# EasyEDA Pro project ProPrj_CGM_BH66F2455_HT32F67595_V1.0.epro

# Schematic CGM_BH66F2455_HT32F67595
Board Name: Board1; Create Date: 2024-12-17; Page Name: P1; Project Name: CGM_BH66F2455_HT32F67595; Schematic Name: CGM_BH66F2455_HT32F67595; Update Date: 2025-05-26; Company: BestHealth; Drawed: viking; Page Size: A4; Version: V1.0
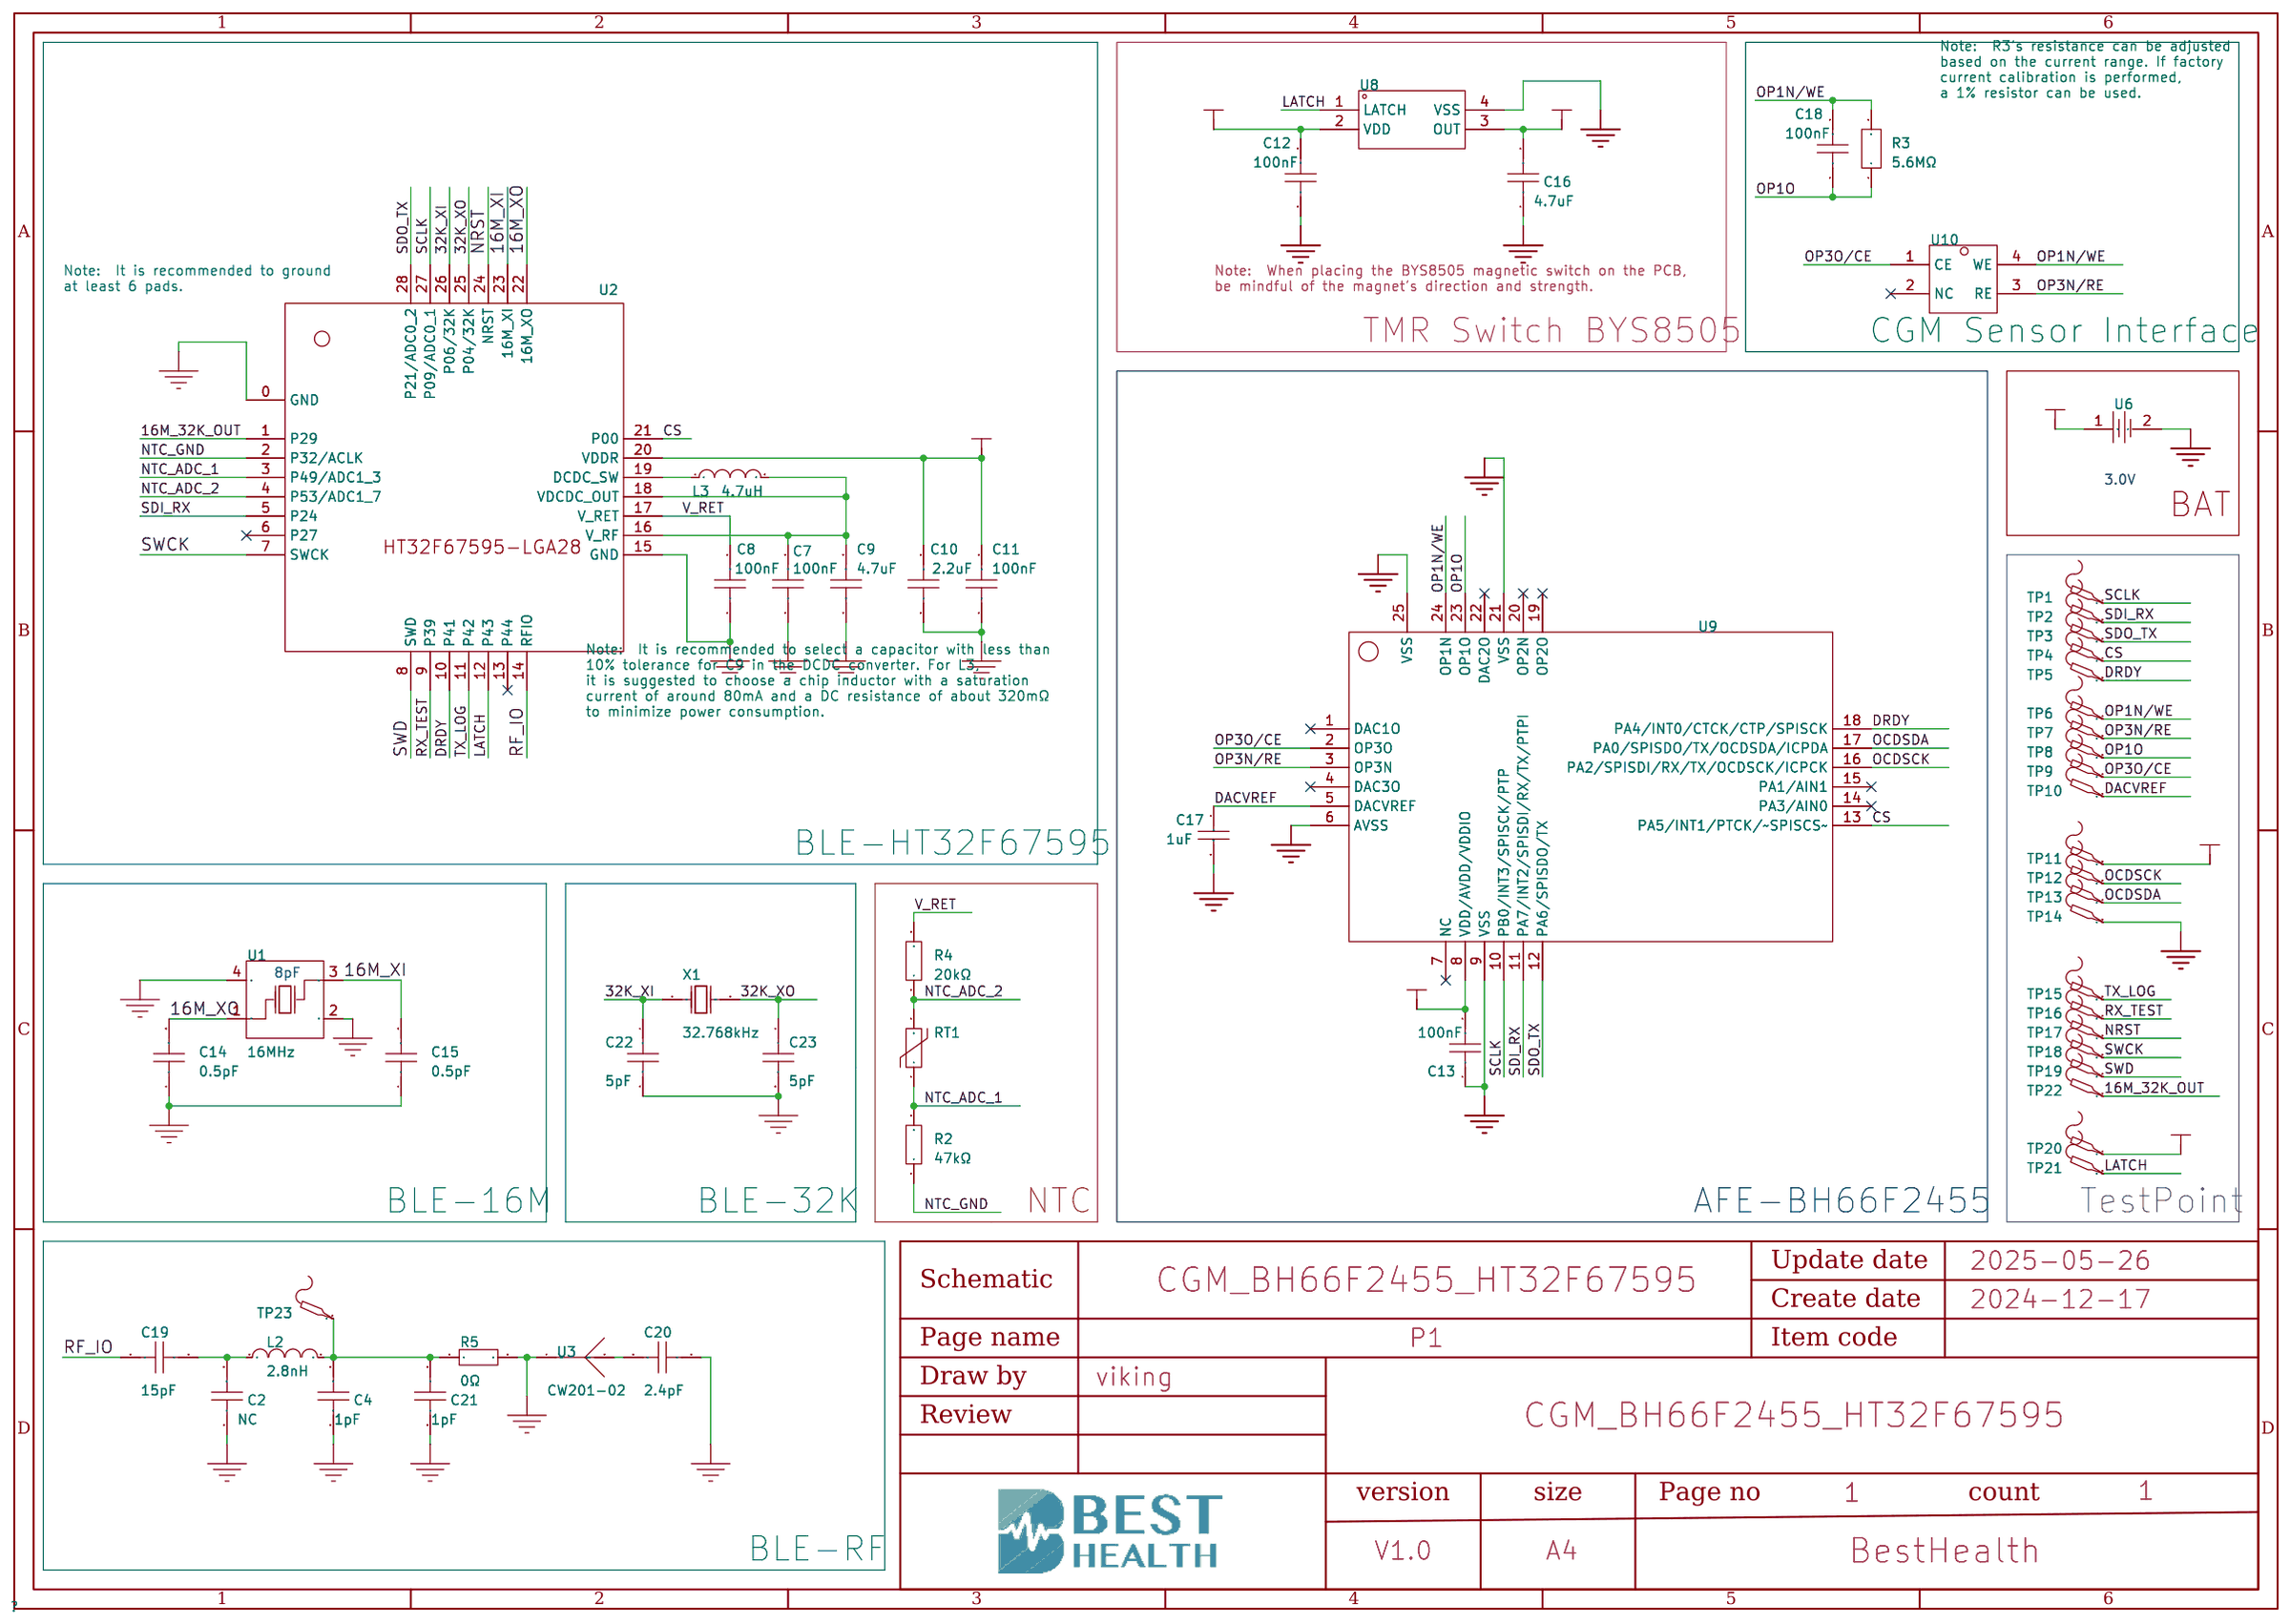
[diagram p0: schematic sheet]

## Parts
C2  1.2pF  [C0201]
C4  1pF  [C0201]
C7  100nF  [C0201]
C8  100nF  [C0201]
C9  4.7uF  [C0402]
C10  2.2uF  [C0201]
C11  100nF  [C0201]
C12  100nF  [C0201]
C13  100nF  [C0201]
C14  0.5pF  [C0201]  (no BOM)
C15  0.5pF  [C0201]  (no BOM)
C16  4.7uF  [C0201]
C17  1uF  [C0201]
C18  100nF  [C0201]
C19  15pF  [C0201]
C20  2.4pF  [C0201]
C21  1pF  [C0201]
C22  5pF  [C0201]  (no BOM)
C23  5pF  [C0201]  (no BOM)
L2  2.8nH  [L0201-RD]
L3  4.7uH  [L0603]
R2  47kΩ  [R0201]
R3  5.6MΩ  [R0402]
R4  20kΩ  [R0201]
R5  0Ω  [R0201]
RT1  NTCG064BF473FTBX  [R0201]
TP1  TP1  [TESTPOINT_1]  (no BOM)
TP2  TP1  [TESTPOINT_1]  (no BOM)
TP3  TP1  [TESTPOINT_1]  (no BOM)
TP4  TP1  [TESTPOINT_1]  (no BOM)
TP5  TP1  [TESTPOINT_1]  (no BOM)
TP6  TP1  [TESTPOINT_1]  (no BOM)
TP7  TP1  [TESTPOINT_1]  (no BOM)
TP8  TP1  [TESTPOINT_1]  (no BOM)
TP9  TP1  [TESTPOINT_1]  (no BOM)
TP10  TP1  [TESTPOINT_1]  (no BOM)
TP11  TP1  [TESTPOINT_1]  (no BOM)
TP12  TP1  [TESTPOINT_1]  (no BOM)
TP13  TP1  [TESTPOINT_1]  (no BOM)
TP14  TP1  [TESTPOINT_1]  (no BOM)
TP15  -  [TESTPOINT_1]  (no BOM)
TP16  -  [TESTPOINT_1]  (no BOM)
TP17  -  [TESTPOINT_1]  (no BOM)
TP18  -  [TESTPOINT_1]  (no BOM)
TP19  -  [TESTPOINT_1]  (no BOM)
TP20  -  [TESTPOINT_1]  (no BOM)
TP21  -  [TESTPOINT_1]  (no BOM)
TP22  -  [TESTPOINT_1]  (no BOM)
TP23  -  [TESTPOINT_1]  (no BOM)
U1  16MHz  [CRYSTAL-SMD_4P-L2.0-W1.6-BL-A]
U2  HT32F67595_LGA28  [LGA28_L3.0_W3.0mm]
U3  CW201-02  [ANT-SMD_L2.0-W1.2_CW201]
U6  CR920  [CR920 Henli Max]
U8  -  [LGA-4_L1.5-W1.5-P0.65-BL]
U9  -  [WQFN-24_L3.0-W3.0-P0.40-TL-EP1.9]
U10  -  [CGM_Sener_V2_TBJ]
X1  32.768kHz  [CRYSTAL-SMD_L1.7-W1.1]

## Library data of the parts
C2 = GJM0335C1H1R2WB01D: 容值:1.2pF;额定电压:50V;材质(温度系数):C0G;; LCSC Part Name: 1.2pF 50V; Supplier Part: C1864231; Manufacturer: muRata(村田); Supplier Footprint: 0201; JLCPCB Part Class: 扩展库; Datasheet: https://atta.szlcsc.com/upload/public/pdf/source/20210503/69FEFD345367A6ED6565135E0189A381.pdf; Supplier: LCSC; Voltage Rated: 50V; Temperature Coefficient: C0G
C4 C21 = GRM0335C1H1R0BA01D: 容值:1pF;精度:-;额定电压:50V;材质(温度系数):C0G;; LCSC Part Name: 1pF 50V; Supplier Part: C85893; Manufacturer: muRata(村田); Supplier Footprint: 0201; JLCPCB Part Class: 扩展库; Datasheet: https://atta.szlcsc.com/upload/public/pdf/source/20200305/C490387_23319AE8C154DEB24C505E6C82A8106A.pdf; Supplier: LCSC; Voltage Rated: 50V; Temperature Coefficient: C0G
C7 C8 C11-C13 C18 = CL03A104KO3NNNC: 容值:100nF;精度:±10%;额定电压:16V;材质(温度系数):X5R;; LCSC Part Name: 100nF ±10% 16V; Supplier Part: C307380; Manufacturer: SAMSUNG(三星); Supplier Footprint: 0201; JLCPCB Part Class: 扩展库; Datasheet: https://atta.szlcsc.com/upload/public/pdf/source/20181009/C307380_E0679AAF9658ADA26DBF30CED0CA6925.pdf; Supplier: LCSC; Tolerance: ±10%; Voltage Rated: 16V; Temperature Coefficient: X5R
C9 = CC0402KRX5R6BB475: 容值:4.7uF;精度:±10%;额定电压:10V;材质(温度系数):X5R;; LCSC Part Name: 4.7uF ±10% 10V; Supplier Part: C326586; Manufacturer: YAGEO(国巨); Supplier Footprint: 0402; Datasheet: https://atta.szlcsc.com/upload/public/pdf/source/20181031/C326586_0A24D5FB832C927D854568E36BF9A1E3.pdf; Supplier: LCSC; Tolerance: ±10%; Voltage Rated: 10V; Temperature Coefficient: X5R
C10 = GRM033R61A225ME47D: 容值:2.2uF;精度:±20%;额定电压:10V;材质(温度系数):X5R;; LCSC Part Name: 2.2uF ±20% 10V; Supplier Part: C319184; Manufacturer: muRata(村田); Supplier Footprint: 0201; JLCPCB Part Class: 扩展库; Datasheet: https://atta.szlcsc.com/upload/public/pdf/source/20181029/C319184_E8D08B09A5B8275146DCCD460C2C3E2F.pdf; Supplier: LCSC; Tolerance: ±20%; Voltage Rated: 10V; Temperature Coefficient: X5R
C14 C15 = GRM0335C1HR50BA01D: 容值:0.5pF;额定电压:50V;温度系数:C0G;; LCSC Part Name: ±0.1pF 0.5pF 50V; Supplier Part: C85920; Manufacturer: muRata(村田); Supplier Footprint: 0201; Datasheet: https://atta.szlcsc.com/upload/public/pdf/source/20200305/C490387_23319AE8C154DEB24C505E6C82A8106A.pdf; Supplier: LCSC; Voltage Rating: 50V; Temperature Coefficient: C0G
C16 = GRM035R60J475ME15D: 容值:4.7uF;精度:±20%;额定电压:6.3V;材质(温度系数):X5R;; LCSC Part Name: 4.7uF ±20% 6.3V; Supplier Part: C335103; Manufacturer: muRata(村田); Supplier Footprint: 0201; JLCPCB Part Class: 扩展库; Datasheet: https://atta.szlcsc.com/upload/public/pdf/source/20181123/C335103_65BC12EC0C1BBB7D605A3646AEC2CDDD.pdf; Supplier: LCSC; Tolerance: ±20%; Voltage Rated: 6.3V; Temperature Coefficient: X5R
C17 = CL03A105MQ3CSNH: 容值:1uF;精度:±20%;额定电压:6.3V;材质(温度系数):X5R;; LCSC Part Name: 1uF ±20% 6.3V; Supplier Part: C53067; Manufacturer: SAMSUNG(三星); Supplier Footprint: 0201; JLCPCB Part Class: 扩展库; Datasheet: https://atta.szlcsc.com/upload/public/pdf/source/20160218/1457707763339.pdf; Supplier: LCSC; Tolerance: ±20%; Voltage Rated: 6.3V; Temperature Coefficient: X5R
C19 = GRM0335C1H150JA01D: 容值:15pF;精度:±5%;额定电压:50V;温度系数:C0G;; LCSC Part Name: 15pF ±5% 50V; Supplier Part: C85891; Manufacturer: muRata(村田); Supplier Footprint: 0201; JLCPCB Part Class: 扩展库; Datasheet: https://atta.szlcsc.com/upload/public/pdf/source/20200305/C490387_23319AE8C154DEB24C505E6C82A8106A.pdf; Supplier: LCSC; Tolerance: ±5%; Voltage Rating: 50V; Temperature Coefficient: C0G
C20 = GRM0335C1E2R4CA01D: 容值:2.4pF;额定电压:25V;温度系数:C0G;; LCSC Part Name: ±0.25pF 2.4pF 25V; Supplier Part: C161385; Manufacturer: muRata(村田); Supplier Footprint: 0201; JLCPCB Part Class: 扩展库; Datasheet: https://atta.szlcsc.com/upload/public/pdf/source/20181011/C161385_74F8CDF2090FF44140FE7D4D8FB954E7.pdf; Supplier: LCSC; Voltage Rating: 25V; Temperature Coefficient: C0G
C22 C23 = GJM0335C1E5R0BB01D: 容值:5pF;额定电压:25V;材质(温度系数):C0G;; LCSC Part Name: 5pF 25V; Supplier Part: C464954; Manufacturer: muRata(村田); Supplier Footprint: 0201; JLCPCB Part Class: 扩展库; Datasheet: https://atta.szlcsc.com/upload/public/pdf/source/20191129/C464954_5BF7E89BC2BFACC5C6B733268D26AC03.pdf; Supplier: LCSC; Voltage Rated: 25V; Temperature Coefficient: C0G
L2 = LQP03TG2N8B02D: 电感值:2.8nH;精度:-;额定电流:450mA;饱和电流(Isat):-;直流电阻(DCR):250mΩ;; Supplier Part: C237463; Manufacturer: muRata(村田); Supplier Footprint: 0201; Datasheet: https://atta.szlcsc.com/upload/public/pdf/source/20181120/C333991_3B037B5A0300CC3F313E5A09B9D1E037.pdf; Supplier: LCSC; Rated Current: 450mA; DC Resistance (DCR): 250mΩ; Q @ Freq: 13@500MHz; Frequency - Self Resonant: 6GHz; Type: 厚膜电感
L3 = MLZ1608N4R7LT000: 电感值:4.7uH;精度:±20%;额定电流:-;饱和电流(Isat):80mA;直流电阻(DCR):320mΩ;; LCSC Part Name: 4.7uH ±20% 80mA; Supplier Part: C383396; Manufacturer: TDK; Supplier Footprint: 0603; JLCPCB Part Class: 扩展库; Datasheet: https://atta.szlcsc.com/upload/public/pdf/source/20200619/C383390_12B08DE970320BE328D08C37492510E7.pdf; Supplier: LCSC; Tolerance: ±20%; Saturation Current (Isat): 80mA; DC Resistance (DCR): 320mΩ; Frequency - Self Resonant: 80MHz
R2 = RC0201FR-0747KL: 电阻类型:厚膜电阻;阻值:47kΩ;精度:±1%;功率:50mW;温度系数:±200ppm/℃;最大工作电压:25V;工作温度范围:-55℃~+155℃;; LCSC Part Name: 47kΩ ±1% 50mW; Supplier Part: C138139; Manufacturer: YAGEO(国巨); Supplier Footprint: 0201; JLCPCB Part Class: 扩展库; Datasheet: https://atta.szlcsc.com/upload/public/pdf/source/20171107/C138139_15100517155931097035.pdf; Supplier: LCSC; Type: 厚膜电阻; Tolerance: ±1%; Power(Watts): 50mW; Temperature Coefficient: ±200ppm/℃; Overload Voltage (Max): 25V; Operating Temperature Range: -55℃~+155℃
R3 = RC0402FR-075M6L: 电阻类型:厚膜电阻;阻值:5.6MΩ;精度:±1%;功率:62.5mW;最大工作电压:50V;温度系数:±100ppm/℃;; LCSC Part Name: 厚膜电阻 5.6MΩ ±1% 62.5mW; Supplier Part: C477755; Manufacturer: YAGEO(国巨); Supplier Footprint: 0402; JLCPCB Part Class: 扩展库; Datasheet: https://atta.szlcsc.com/upload/public/pdf/source/20200715/C477755_2FF05B608096128DB9D1572F7AA4D559.pdf; Supplier: LCSC; Type: 厚膜电阻; Tolerance: ±1%; Power(Watts): 62.5mW; Overload Voltage (Max): 50V; Temperature Coefficient: ±100ppm/℃; Operating Temperature Range: -55℃~+155℃
R4 = RC0201FR-0720KL: 电阻类型:厚膜电阻;阻值:20kΩ;精度:±1%;功率:50mW;最大工作电压:25V;温度系数:±200ppm/℃;; LCSC Part Name: 厚膜电阻 20kΩ ±1% 50mW; Supplier Part: C295787; Manufacturer: YAGEO(国巨); Supplier Footprint: 0201; JLCPCB Part Class: 扩展库; Datasheet: https://atta.szlcsc.com/upload/public/pdf/source/20181009/C309620_DA5935B6E1D48212CB7A533FE518B3C2.pdf; Supplier: LCSC; Type: 厚膜电阻; Tolerance: ±1%; Power(Watts): 50mW; Overload Voltage (Max): 25V; Temperature Coefficient: ±200ppm/℃; Operating Temperature Range: -55℃~+125℃
R5 = RC0201FR-070RL: 电阻类型:厚膜电阻;阻值:0Ω;精度:±1%;功率:50mW;最大工作电压:25V;温度系数:-;; LCSC Part Name: 厚膜电阻 0Ω ±1% 50mW; Supplier Part: C106227; Manufacturer: YAGEO(国巨); Supplier Footprint: 0201; Datasheet: https://atta.szlcsc.com/upload/public/pdf/source/20180821/C275644_0D56F95EFF785E7D9A1FEF436B37DA78.pdf; Supplier: LCSC; Type: 厚膜电阻; Tolerance: ±1%; Power(Watts): 50mW; Overload Voltage (Max): 25V; Operating Temperature Range: -55℃~+125℃
RT1 = NTCG064BF473FTBX: 阻值(25℃):47kΩ;电阻精度:±1%;B值精度:±1%;B值(25℃/50℃):4050K;功率:100mW;最大稳态电流(25℃):140uA;; LCSC Part Name: 47kΩ 电阻精度:±1% 4050K; Supplier Part: C387869; Manufacturer: TDK; Supplier Footprint: 0201; JLCPCB Part Class: 扩展库; Datasheet: https://atta.szlcsc.com/upload/public/pdf/source/20190412/C387869_7488A33476C163DAFB157DE1B3701229.pdf; Supplier: LCSC; Resistance @ 25℃: 47kΩ; Resistance Tolerance: ±1%; B Constant Tolerance: ±1%; B Constant (25℃/50℃): 4050K; Power: 100mW; Steady State Current (Max): 140uA; B Constant (25℃/75℃): 4098K; B Constant (25℃/85℃): 4114K; B Constant (25℃/100℃): 4137K; Operating Temperature: -40℃~+125℃
TP1-TP23 = Test-Point: Test Point 测试点
U1 = XL7EL89CKI-111YLC-16M: 频率:16MHz;负载电容:8pF;频率公差:±10ppm;; LCSC Part Name: 16MHz ±10ppm 8pF YSX211SL; Supplier Part: C2965577; Manufacturer: YXC(扬兴晶振); Supplier Footprint: SMD2016-4P; Datasheet: https://atta.szlcsc.com/upload/public/pdf/source/20220121/6B4B3E7EF7974858943D806BF8CACEA3.pdf; Supplier: LCSC; Crystal Type: 贴片无源晶振; Load Capacitance: 8pF; Frequency Tolerance: ±10ppm; Frequency Stability: ±20ppm; Operating Temperature: -40℃~+85℃
U2 = HT32F67595_LGA28: Check: true
U3 = CW201-02: LCSC Part Name: LXC(连兴创)陶瓷SMT天线-CW201; Supplier Part: C42379496; Manufacturer: LXC(连兴创); JLCPCB Part Class: 扩展库; Datasheet: https://atta.szlcsc.com/upload/public/pdf/source/20241122/D5EBC13B9CDD4B62BA2D0887DE2C1252.pdf; Supplier: LCSC
U6 = CR920 Henli Max: 常州宇峰电池
U8 = BYS8505
U9 = BH66F2455: 该单片机是一款 A/D 型具有 8 位高性能精简指令集的 Flash 单片机，内置连续 / 血糖监测 AFE 模块，专门为连续血糖监测产品而设计。; Manufacturer: HOLTEK
U10 = CGM_Sensor_V2_TBJ
X1 = X1A0001210005_C5154201: 频率:32.768kHz;外接负载电容:12.5pF;; LCSC Part Name: 32.768kHz 12.5pF; Supplier Part: C5154201; Manufacturer: EPSON(爱普生); Manufacturer Part: X1A0001210005; Supplier Footprint: SMD1610-2P; Datasheet: https://atta.szlcsc.com/upload/public/pdf/source/20220902/8E45647E0861F7DDF8A395DB16B8FC1E.pdf; Supplier: LCSC; External load capacitor: 12.5pF

## Nets
GND: C2.1 C4.1 C7.1 C8.1 C9.1 C10.1 C11.1 C12.1 C13.1 C14.1 C15.1 C16.1 C17.2 C20.1 C21.1 C22.2 C23.2 R5.2 TP14.1 U1.2(GND) U1.4(GND) U2.0(GND) U2.15(GND) U3.1(Signal Input) U6.2 U8.4(VSS) U9.6(AVSS) U9.9(VSS) U9.21(VSS) U9.25(VSS)
VBAT: C12.2 TP20.1 U6.1 U8.2(VDD)
VDD: C10.2 C11.2 C13.2 C16.2 TP11.1 U2.20(VDDR) U8.3(OUT) U9.8(VDD/AVDD/VDDIO)
16M_32K_OUT: TP22.1 U2.1(P29)
16M_XI: C15.2 U1.3(OSC2) U2.23(16M_XI)
16M_XO: C14.2 U1.1(OSC1) U2.22(16M_XO)
32K_XI: C22.1 U2.26(P06/32K) X1.1(OSC1)
32K_XO: C23.1 U2.25(P04/32K) X1.2(OSC2)
CS: TP4.1 U2.21(P00) U9.13(PA5/INT1/PTCK/~SPISCS~)
DACVREF: C17.1 TP10.1 U9.5(DACVREF)
DRDY: TP5.1 U2.10(P41) U9.18(PA4/INT0/CTCK/CTP/SPISCK)
LATCH: TP21.1 U2.12(P43) U8.1(LATCH)
NRST: TP17.1 U2.24(NRST)
NTC_ADC_1: R2.2 RT1.1 U2.3(P49/ADC1)
NTC_ADC_2: R4.1 RT1.2 U2.4(P53/ADC1_7)
NTC_GND: R2.1 U2.2(P32/ACLK)
OCDSCK: TP12.1 U9.16(PA2/SPISDI/RX/TX/OCDSCK/ICPCK)
OCDSDA: TP13.1 U9.17(PA0/SPISDO/TX/OCDSDA/ICPDA)
OP1N/WE: C18.2 R3.2 TP6.1 U9.24(OP1N) U10.4(WE)
OP1O: C18.1 R3.1 TP8.1 U9.23(OP1O)
OP3N/RE: TP7.1 U9.3(OP3N) U10.3(RE)
OP3O/CE: TP9.1 U9.2(OP3O) U10.1(CE)
RF_IO: C19.1 U2.14(RFIO)
RX_TEST: TP16.1 U2.9(P39)
SCLK: TP1.1 U2.27(P09/ADC0_1) U9.10(PB0/INT3/SPISCK/PTP)
SDI_RX: TP2.1 U2.5(P24) U9.11(PA7/INT2/SPISDI/RX/TX/PTPI)
SDO_TX: TP3.1 U2.28(P21/ADC0_2) U9.12(PA6/SPISDO/TX)
SWCK: TP18.1 U2.7(SWCK)
SWD: TP19.1 U2.8(SWD)
TX_LOG: TP15.1 U2.11(P42)
V_RET: C8.2 R4.2 U2.17(V_RET)
$1N117316: L3.1 U2.19(DCDC_SW)
$1N117324: C20.2 U3.2(Tuning/Signal Output)
$1N117351: C7.2 C9.2 L3.2 U2.16(V_RF) U2.18(VDCDC_OUT)
$1N163267: C2.2 C19.2 L2.1
$1N163559: C4.2 C21.2 L2.2 R5.1 TP23.1

Not connected (* = marked no-connect by the designer): U2 6(P27)* 13(P44)*; U9 1(DAC1O)* 4(DAC3O)* 7(NC)* 14(PA3/AIN0)* 15(PA1/AIN1)* 19(OP2O)* 20(OP2N)* 22(DAC2O)*; U10 2(NC)*

## Notes on the sheet
- Note:  R3's resistance can be adjusted
  based on the current range. If factory
  current calibration is performed,
  a 1% resistor can be used.
- Note:  It is recommended to ground
  at least 6 pads.
- Note:  When placing the BYS8505 magnetic switch on the PCB,
  be mindful of the magnet's direction and strength.
- TMR Switch BYS8505
- CGM Sensor Interface
- 3.0V
- BAT
- Note:  It is recommended to select a capacitor with less than
  10% tolerance for C9 in the DCDC converter. For L3,
  it is suggested to choose a chip inductor with a saturation
  current of around 80mA and a DC resistance of about 320mΩ
  to minimize power consumption.
- BLE-HT32F67595
- 8pF
- BLE-16M
- BLE-32K
- NTC
- AFE-BH66F2455
- TestPoint
- BLE-RF

# Board CGM_BH66F2455_HT32F67595
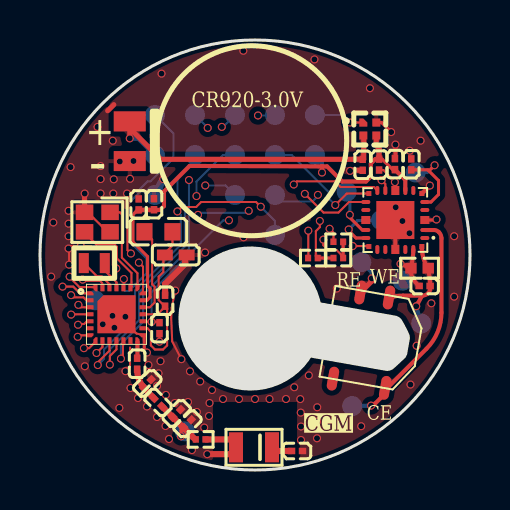
[diagram p1: board, top side]
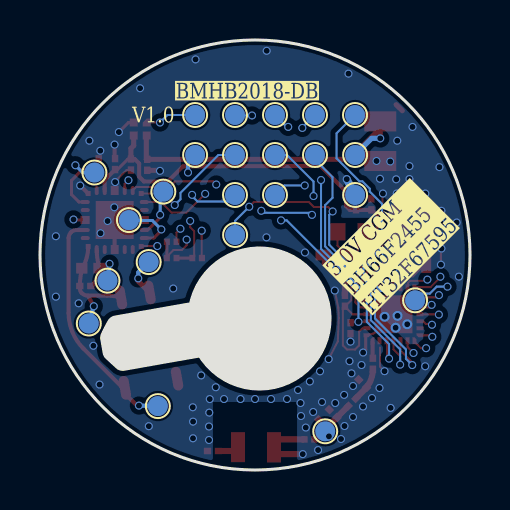
[diagram p2: board, bottom side, seen from below]

Outline 21.5 x 21.5 mm; copper layers: Top Layer, Inner1, Inner2, Bottom Layer. Coordinates in mm from the lower left corner of the outline.
Outline path: circle c10.75,10.75 r10.75
Stack: Top Layer 0.035mm 外层铜厚1oz / Dielectric1 0.2133mm 7628 RC49% 8.6mil / Inner1 0.035mm 内层铜厚 / Dielectric2 0.2133mm 1.1mm H/HOZ Copper / Inner2 0.035mm 内层铜厚 / Dielectric3 0.2133mm 7628 RC49% 8.6mil / Bottom Layer 0.035mm 外层铜厚1oz

## Design rules (mm)
template: 自定义配置
spacing copperThickness1oz (default): track to track 0.102, other pairs 0.102 to 0.3
spacing copperThickness2oz: track to track 0.203, other pairs 0.152 to 0.3
spacing copperThicknessInner0.5oz: track to track 0.089, other pairs 0.152 to 0.3
track width copperThickness1oz (default): min 0.102, default 0.254, max 2.54
track width copperThickness2oz: min 0.203, default 0.254, max 2.54
track width copperThickness0.5oz: min 0.089, default 0.254, max 2.54
differential pair differentialPair (default): width min 0.127, default 0.254, max 2.54; gap min 0.152, default 0.152
via viaSize (default): diameter min 0.3, default 0.61, max 10; hole min 0.201, default 0.305, max 6.299

## Placement (name value [footprint] x y rotation side)
C2  1.2pF  [C0201]  5.37 4.32 225 top
C4  1pF  [C0201]  6.84 2.83 225 top
C7  100nF  [C0201]  6.25 8.46 270 top
C8  100nF  [C0201]  5.97 7.09 90 top
C9  4.7uF  [C0402]  6.79 10.75 180 top
C10  2.2uF  [C0201]  4.93 13.28 270 top
C11  100nF  [C0201]  5.7 13.29 270 top
C12  100nF  [C0201]  16.13 15.26 90 top
C13  100nF  [C0201]  17.75 15.3 270 top
C16  4.7uF  [C0201]  16.95 15.27 90 top
C17  1uF  [C0201]  18.56 15.28 90 top
C18  100nF  [C0201]  19.23 9.2 0 top
C19  15pF  [C0201]  4.86 5.31 270 top
C20  2.4pF  [C0201]  12.85 0.95 180 top
C21  1pF  [C0201]  7.37 2.32 225 top
L2  2.8nH  [L0201-RD]  5.9 3.38 315 top
L3  4.7uH  [L0603]  5.92 11.91 0 top
R2  47kΩ  [R0201]  14.92 11.41 0 top
R3  5.6MΩ  [R0402]  18.98 10.09 0 top
R4  20kΩ  [R0201]  13.65 10.6 180 top
R5  0Ω  [R0201]  8.03 1.53 0 top
RT1  NTCG064BF473FTBX  [R0201]  14.92 10.6 180 top
TP1  TP1  [TESTPOINT_1]  11.75 13.75 0 bottom
TP2  TP1  [TESTPOINT_1]  9.75 13.75 0 bottom
TP3  TP1  [TESTPOINT_1]  11.75 15.75 0 bottom
TP4  TP1  [TESTPOINT_1]  9.75 15.75 0 bottom
TP5  TP1  [TESTPOINT_1]  11.75 11.75 0 bottom
TP6  TP1  [TESTPOINT_1]  19.06 7.32 0 bottom
TP7  TP1  [TESTPOINT_1]  16.07 10.4 0 bottom
TP8  TP1  [TESTPOINT_1]  18.13 9.47 0 bottom
TP9  TP1  [TESTPOINT_1]  15.61 3.19 0 bottom
TP10  TP1  [TESTPOINT_1]  18.78 14.87 0 bottom
TP11  TP1  [TESTPOINT_1]  13.75 15.75 0 bottom
TP12  TP1  [TESTPOINT_1]  15.33 13.92 0 bottom
TP13  TP1  [TESTPOINT_1]  17.05 12.49 0 bottom
TP14  TP1  [TESTPOINT_1]  5.75 13.75 0 bottom
TP15  -  [TESTPOINT_1]  7.75 15.75 0 bottom
TP16  -  [TESTPOINT_1]  11.75 17.75 0 bottom
TP17  -  [TESTPOINT_1]  5.75 17.75 0 bottom
TP18  -  [TESTPOINT_1]  7.75 17.75 0 bottom
TP19  -  [TESTPOINT_1]  9.75 17.75 0 bottom
TP20  -  [TESTPOINT_1]  5.75 15.75 0 bottom
TP21  -  [TESTPOINT_1]  13.75 17.75 0 bottom
TP22  -  [TESTPOINT_1]  2.75 8.48 180 bottom
TP23  -  [TESTPOINT_1]  7.24 1.94 180 bottom
U1  16MHz  [CRYSTAL-SMD_4P-L2.0-W1.6-BL-A]  2.87 12.4 180 top
U2  HT32F67595_LGA28  [LGA28_L3.0_W3.0mm]  3.82 7.79 0 top
U3  CW201-02  [ANT-SMD_L2.0-W1.2_CW201]  10.7 1.13 0 top
U6  CR920  [CR920 Henli Max]  10.58 16.46 180 top
U8  -  [LGA-4_L1.5-W1.5-P0.65-BL]  16.49 17.05 270 top
U9  -  [WQFN-24_L3.0-W3.0-P0.40-TL-EP1.9]  17.77 12.5 180 top
U10  -  [CGM_Sener_V2_TBJ]  17.45 8.62 170 top
X1  32.768kHz  [CRYSTAL-SMD_L1.7-W1.1]  2.71 10.35 0 top

## Footprints (pads in the part's own frame, mm; a bottom-side part is the same pattern mirrored in y, then rotated)
ANT-SMD_L2.0-W1.2_CW201
  rect 0.7x1.5 smd: 1(-0.9,-0.001) 2(0.9,0.001)
C0201
  rect 0.368x0.324 smd: 1(-0.275,0) 2(0.275,0)
C0402
  rect 0.79x0.54 smd: 1(-0.545,0) 2(0.545,0)
CGM_Sener_V2_TBJ
  oval 0.5x1.2 smd: 1(-0.595,4.482) 2(2.055,4.482) 3(1.45,0) 4(0,0)
CR920 Henli Max
  rect 1.6x1 smd: 1(6.096,-0.968) 2(6.096,1.016)
CRYSTAL-SMD_4P-L2.0-W1.6-BL-A
  rect 0.875x0.775 smd: 1(-0.638,-0.488) 2(0.638,-0.488) 3(0.638,0.488) 4(-0.638,0.488)
CRYSTAL-SMD_L1.7-W1.1
  rect 0.5x1 smd: 1(-0.525,0) 2(0.525,0)
L0201-RD
  rect 0.368x0.324 smd: 1(-0.275,0) 2(0.275,0)
L0603
  rect 0.8x0.864 smd: 1(-0.7,0) 2(0.7,0)
LGA28_L3.0_W3.0mm
  custom 1.9x1.9 smd: 0(0,0)
  custom 0.35x0.2 smd: 1(-1.375,1.05) 7(-1.375,-1.05) 15(1.375,-1.05) 21(1.375,1.05)
  rect 0.35x0.2 smd: 2(-1.325,0.7) 3(-1.325,0.35) 4(-1.325,0) 5(-1.325,-0.35) 6(-1.325,-0.7) 16(1.325,-0.7) 17(1.325,-0.35) 18(1.325,0) 19(1.325,0.35) 20(1.325,0.7)
  custom 0.2x0.35 smd: 8(-1.05,-1.375) 14(1.05,-1.375) 22(1.05,1.375) 28(-1.05,1.375)
  rect 0.2x0.35 smd: 9(-0.7,-1.325) 10(-0.35,-1.325) 11(0,-1.325) 12(0.35,-1.325) 13(0.7,-1.325) 23(0.7,1.325) 24(0.35,1.325) 25(0,1.325) 26(-0.35,1.325) 27(-0.7,1.325)
LGA-4_L1.5-W1.5-P0.65-BL
  custom 0.4x0.4 smd: 1(-0.325,-0.325)
  rect 0.4x0.4 smd: 2(0.325,-0.325) 3(0.325,0.325) 4(-0.325,0.325)
R0201
  rect 0.303x0.324 smd: 1(-0.241,0) 2(0.241,0)
R0402
  rect 0.566x0.54 smd: 1(-0.433,0) 2(0.433,0)
TESTPOINT_1
  round 1 smd: 1(0,-0.001)
WQFN-24_L3.0-W3.0-P0.40-TL-EP1.9
  oval 0.45x0.2 smd: 1(-1.475,0.9) 2(-1.475,0.5) 4(-1.475,-0.5) 5(-1.475,-0.9) 13(1.475,-0.9) 14(1.475,-0.5) 16(1.475,0.5) 17(1.475,0.9)
  rect 0.45x0.4 smd: 3(-1.475,0) 15(1.475,0)
  rect 0.25x0.25 smd: 6(-1.325,-1.325) 12(1.325,-1.325) 18(1.325,1.325) 24(-1.325,1.325)
  oval 0.2x0.45 smd: 7(-0.9,-1.475) 8(-0.5,-1.475) 10(0.5,-1.475) 11(0.9,-1.475) 19(0.9,1.475) 20(0.5,1.475) 22(-0.5,1.475) 23(-0.9,1.475)
  rect 0.4x0.45 smd: 9(0,-1.475) 21(0,1.475)
  rect 1.9x1.9 smd: 25(0,0)

## Nets
As in the schematic.

Pads without a net: U2 6 13; U9 1 4 7 14 15 19 20 22; U10 2

## Via types
v1: diameter 0.4, hole 0.3, Top Layer to Bottom Layer, 139 vias
v2: diameter 0.5, hole 0.3, Top Layer to Bottom Layer, 4 vias

## Routing (per net, layer and track width the routed paths; a pad name or vN(x,y) marks a point on that pad's centre or on a via; arc(x,y) is an arc through that point)
GND: length 31
  Top Layer w0.102: v1(4.54,10.82) 4.37,10.99 4.37,13.8 v1(4.35,13.82) ; v1(1.45,10.27) 1.45,11.05 v1(1.43,11.07) 1.55,11.19 v1(2.04,11.19) 2.53,11.19 2.65,11.08 3.54,11.08 3.64,10.98 3.64,10.25 v1(3.81,10.08) ; C16.1 17.17,15 17.75,14.42 v1(17.75,14.4) arc(17.78,14.19) U9.9 ; U1.2 2.39,12.88 3.37,11.91 U1.4 ; v1(4.27,4.94) 4.5,5.17 4.5,6.12 ; U2.0 4.82,6.83 U2.15 ; C8.1 v1(5.97,6.42) ; v1(7.07,5.54) 6.61,6.43 6.56,7.6 6.58,8.11 v1(6.76,8.97)
  Top Layer w0.152: U2.15 5.21,6.72 5.21,6 v1(5.34,5.87) ; v1(17.56,16.9) 17.08,17.37 U8.4
  Top Layer w0.203: U9.21 U9.25 ; 19.09,13.82 19.09,13.82 v1(19.49,14.22) ; v1(17.77,16.27) 17.77,15.59 C13.1
  Top Layer w0.254: U1.2 2.23,13.82 v1(2.24,13.82) ; v1(15.5,14.96) 15.53,14.98 C12.1 ; 3.69,18.27 arc(3.54,18.11) 3.38,17.96
  Top Layer w0.305: C7.1 6.25,9.3 7.26,10.31 7.26,10.77 ; 8.31,1.53 9.8,1.53 U3.1 9.8,0.81 9.78,0.79 v1(8.36,0.79)
  Bottom Layer w0.381: v1(6.16,14.54) TP14.1
  vias: v1(0.56,9.67) v1(0.67,12.38) v1(1.43,12.96) v1(1.43,12.32) v1(1.43,11.69) v1(1.53,15.14) v1(2.24,5.19) v1(2.88,17.15) v1(3.03,15.19) v1(3.03,14.55) v1(3.03,13.83) v1(3.64,16.46) v1(3.69,14.53) v1(3.66,13.82) v1(3.99,15.42) v1(3.97,3.1) v1(4.5,14.56) v1(4.52,4.1) v1(4.67,15.45) v1(4.9,3.6) v1(5.35,3.17) v1(5.42,5.25) v1(5.85,4.2) v1(5.85,2.65) v1(5.93,4.83) v1(6.08,19.82) v1(6.03,5.44) v1(6.29,3.76) v1(6.28,2.2) v1(6.45,1.55) v1(6.74,3.35) v1(7.5,4.93) v1(7.4,3.4) v1(7.6,1) v1(7.84,2.9) v1(8.01,4.43) v1(8.25,10.88) v1(8.21,2.12) v1(8.47,3.35) v1(8.45,2.7) v1(8.6,4) v1(9.15,3.55) v1(9.95,3.55) v1(10.17,20.96) v1(10.18,11.63) v1(10.75,3.55) v1(11.47,3.55) v1(12.3,3.55) v1(12.71,4.14) v1(13.01,3.55) v1(13.04,2.87) v1(13.05,2.17) v1(13.05,1.5) v1(13.44,4.73) v1(13.72,20.53) v1(13.86,3.14) v1(13.85,2.42) v1(13.85,1.59) v1(14.84,9.07) v1(16.06,2.19) v1(16.5,19.09) v1(17.79,13.14) v1(18.12,12.45) v1(18.49,15.96) v1(18.47,11.84) v1(18.52,4.27) v1(18.83,6.21) v1(19.03,16.47) v1(19.57,8.34) v1(20.71,11.69) v1(20.71,8.67) v2(3.14,7.29) v2(3.62,7.71) v2(3.72,7.11) v2(4.27,7.66)
VBAT: length 16
  Top Layer w0.254: U8.2 16.19,16.7 16.19,15.53 6.04,15.53 4.49,17.08 ; U6.1 4.49,17.08 ; 4.49,17.08 v1(4.49,16.58)
  Bottom Layer w0.254: v1(4.49,16.58) 4.92,16.58 5.75,15.75
VDD: length 24.7
  Top Layer w0.152: C13.2 17.63,15.02 17.1,15.55 C16.2 ; C10.2 4.88,13.01 4.65,12.77 4.65,11.4 5.38,10.67 5.38,9.19 5.5,9.07 5.5,8.64 5.35,8.49 U2.20
  Top Layer w0.203: 14.1,15.18 7.48,15.2 6.2,13.92 6.2,13.2 6,13 5.71,13 C11.2 5.69,13.01 C10.2 ; 14.1,15.18 v1(14.1,14.87) ; 14.1,15.18 14.35,15.18 15.11,14.42 16.3,14.42 16.54,14.67 16.54,15.32 16.76,15.55 C16.2 ; U9.8 18.27,14.5 C13.2
  Top Layer w0.254: U8.3 16.82,16.22 16.95,16.08 C16.2
  Bottom Layer w0.203: v1(14.1,14.87) 14.1,15.39 TP11.1
16M_32K_OUT: length 3.4
  Top Layer w0.102: U2.1 1.99,8.84 1.66,9.17 v1(1.13,9.17)
  Bottom Layer w0.102: v1(1.13,9.17) 1.66,9.17 2.01,8.82 2.52,8.82 2.74,8.6 2.74,8.48
16M_XI: length 4.3
  Top Layer w0.102: U2.23 4.57,9.16 4.57,9.85 3.84,10.58 3.84,11.16 3.72,11.28 2.81,11.28 2.23,11.87 U1.3
16M_XO: length 4.6
  Top Layer w0.102: U1.1 3.99,12.88 4.09,12.78 4.09,10.62 4.87,9.84 U2.22
32K_XI: length 1.9
  Top Layer w0.102: X1.1 2.85,9.68 3.08,9.68 3.47,9.29 U2.26
32K_XO: length 1.5
  Top Layer w0.102: U2.25 3.82,9.39 3.24,9.97 X1.2
CS: length 20.1
  Top Layer w0.102: U2.21 5.15,8.88 5.15,10.17 v1(4.94,10.37) ; U9.13 15.45,13.4 14.92,12.87 14.18,12.87 v1(13.24,13.81)
  Inner2 w0.102: v1(13.24,13.81) 13.23,13.82 11.82,13.82 11.57,14.07 8.88,14.07 8.47,13.66 8.47,13.58 8.28,13.39 8.13,13.39 v1(7.82,13.7) 5.96,13.7 4.94,12.68 v1(4.94,10.37)
  Bottom Layer w0.102: v1(7.82,13.7) 7.82,14.42 9.15,15.75 9.75,15.75
DACVREF: length 4.6
  Top Layer w0.152: 19.45,14.95 19.93,14.47 19.93,13.77 19.55,13.4 U9.5 ; 19.45,14.95 19.39,15.01 C17.1 ; 19.45,14.95 v1(19.73,15.24)
  Bottom Layer w0.152: TP10.1 19.37,14.87 v1(19.73,15.24)
DRDY: length 23.5
  Top Layer w0.102: v1(2.89,5.25) 2.89,5.38 3.47,5.97 U2.10 ; v1(15.63,11.2) 16.42,11.2 U9.18 ; v1(11.04,13.16) 10.8,13.4 8.06,13.4 7.81,13.15 7.09,13.15 v1(6.87,12.93)
  Inner2 w0.102: v1(15.63,11.2) 14.94,11.89 14.94,12.27 14.19,13.03 11.76,13.03 11.62,13.16 v1(11.04,13.16)
  Bottom Layer w0.102: TP5.1 11.75,12.46 v1(11.04,13.16) ; v1(6.87,12.93) 7.04,12.75 7.04,11.27 4.75,8.98 4.75,7.58 3.2,6.03 3.2,5.56 v1(2.89,5.25)
LATCH: length 24.3
  Top Layer w0.102: U2.12 4.15,6.44 4.15,5.67 v1(4.05,5.57) ; U8.1 v1(15.5,17.37)
  Inner2 w0.102: v1(7.45,14.5) 8,14.5 8.16,14.65 12.9,14.65 13.05,14.5 14.47,14.5 15.5,15.53 v1(15.5,17.37)
  Bottom Layer w0.102: v1(4.05,5.57) 4.05,6.3 5.16,7.41 5.16,8.77 7.45,11.06 v1(7.45,14.5) ; v1(15.5,17.37) 15.13,17.75 13.75,17.75
NRST: length 12.2
  Top Layer w0.102: v1(4.19,9.55) 4.19,9.13 U2.24
  Bottom Layer w0.102: 5.75,17.75 6.67,16.83 6.67,15.58 5.52,14.43 5.38,14.43 5.01,14.07 5.01,13.92 4.4,13.31 4.4,11.5 5.32,10.58 5.32,9.83 4.44,8.95 4.25,8.95 4.19,9.01 v1(4.19,9.55)
NTC_ADC_1: length 17.1
  Top Layer w0.102: v1(14.17,11.52) 14.17,11.24 14.41,11 14.82,11 15.16,10.67 ; v1(1.92,8.26) 2.04,8.14 U2.3
  Top Layer w0.152: R2.2 RT1.1
  Inner2 w0.102: v1(1.92,8.26) 2.04,8.13 4.67,8.13 8.59,12.05 12.8,12.05 13.35,11.5 14.15,11.5 v1(14.17,11.52)
NTC_ADC_2: length 18.7
  Top Layer w0.102: R4.1 13.79,10.69 13.79,11.94 13.99,12.14 v1(13.99,12.45) ; 2.45,7.79 1.57,7.79 v1(1.56,7.77)
  Top Layer w0.152: R4.1 RT1.2
  Inner1 w0.102: v1(7.9,12.76) 7.9,12.4 4.27,8.77 2.99,8.77 1.99,7.77 v1(1.56,7.77)
  Inner2 w0.102: v1(13.99,12.45) 13.88,12.45 13.57,12.76 13.44,12.76 13.41,12.79 10.61,12.79 v1(10.44,12.96)
  Bottom Layer w0.102: v1(10.44,12.96) 10.33,12.86 8,12.86 v1(7.9,12.76)
NTC_GND: length 17.1
  Top Layer w0.102: v1(14.48,12.06) 14.67,11.87 R2.1 ; v1(1.55,8.74) 1.66,8.63 2.17,8.63 2.32,8.49 U2.2
  Inner2 w0.102: v1(1.55,8.74) 1.66,8.64 2.42,8.64 2.72,8.34 4.59,8.34 9.11,12.86 9.78,12.86 10.06,12.58 13.33,12.58 13.85,12.06 v1(14.48,12.06)
OCDSCK: length 2.4
  Top Layer w0.152: U9.16 16.11,12 15.49,12.62 v1(15.49,12.76)
  Bottom Layer w0.152: v1(15.49,12.76) 15.49,13.77 15.34,13.92
OCDSDA: length 2.8
  Top Layer w0.152: U9.17 15.8,11.6 15.43,11.97 v1(15.43,12.03)
  Bottom Layer w0.152: v1(15.43,12.03) 15.88,12.47 16.93,12.47
OP1N/WE: length 5.9
  Top Layer w0.203: 19.1,8.72 18.14,8.72 arc(17.79,8.69) U10.4 ; 19.1,8.72 v1(18.81,8.19) ; 19.1,8.72 arc(19.27,8.75) 19.41,8.84 arc(19.48,8.95) 19.51,9.08 C18.2 arc(19.48,9.65) 19.39,10.09 arc(19.17,10.61) 19.09,11.17
  Bottom Layer w0.203: TP6.1 v1(18.81,8.19)
OP1O: length 3.4
  Top Layer w0.203: 18.52,10.1 v1(18.02,10.31) ; 18.52,10.1 R3.1 ; 18.52,10.1 arc(18.63,10.56) U9.23 ; 18.52,10.1 arc(18.52,10.09) 18.52,10.09 arc(18.64,9.59) 18.96,9.2
  Bottom Layer w0.203: TP8.1 v1(18.02,10.31)
OP3N/RE: length 7
  Top Layer w0.152: v1(19.82,12.53) 19.8,12.5 U9.3
  Top Layer w0.254: U10.3 16.59,9.44 v1(16.59,9.58)
  Inner2 w0.203: v1(16.59,9.58) 17.79,10.78 arc(18.26,11.18) 18.8,11.49 arc(19.41,11.91) v1(19.82,12.53)
  Bottom Layer w0.203: 16.07,10.4 16.59,9.88 v1(16.59,9.58)
OP3O/CE: length 11.8
  Top Layer w0.203: U9.2 19.69,12 arc(19.83,11.97) 19.94,11.89 arc(20.04,11.75) 20.07,11.59 20.07,7.86 arc(19.88,6.89) 19.33,6.07 17.44,4.19 arc(17.36,4.13) U10.1 17.26,3.82 16.65,3.22 v1(16.55,3.22)
  Bottom Layer w0.203: 15.61,3.19 v1(16.55,3.22)
RF_IO: length 0.8
  Top Layer w0.203: U2.14 4.87,5.57
RX_TEST: length 17.6
  Top Layer w0.102: U2.9 3.12,6.15 v1(2.83,5.85)
  Inner1 w0.102: v1(10.9,17.73) 10.38,17.73 9.05,16.4 9.05,12.39 5.03,8.38 5.03,7.28 4.03,6.28 3.36,6.28 2.91,5.82 2.83,5.82 v1(2.83,5.85)
  Bottom Layer w0.102: 11.75,17.75 11.73,17.73 v1(10.9,17.73)
SCLK: length 22.7
  Top Layer w0.102: U9.10 17.27,14.3 v1(17.08,14.49) ; v1(2.13,9.52) 2.2,9.46 3,9.46 3.1,9.35 3.1,9.09 3.12,9.08
  Inner2 w0.102: v1(17.08,14.49) 16.82,14.23 14.37,14.23 v1(13.9,13.76) 13.57,13.43 11.93,13.43 11.49,13.87 8.97,13.87 8.67,13.58 8.67,13 4.47,8.79 2.86,8.79 v1(2.13,9.52)
  Bottom Layer w0.102: v1(13.9,13.76) 13.9,13.69 13.62,13.42 12.08,13.42 11.75,13.75
SDI_RX: length 21.6
  Top Layer w0.102: v1(12.69,14.27) 12.85,14.43 14.74,14.43 15.03,14.15 16.69,14.15 U9.11 ; v1(1.9,7.26) 1.94,7.3 2.21,7.3 2.33,7.43 2.44,7.43 2.45,7.44
  Inner1 w0.102: v1(1.9,7.26) 1.9,7.38 3.09,8.57 4.36,8.57 8.37,12.57 8.37,14.12 v1(8.26,14.23)
  Inner2 w0.102: v1(8.26,14.23) 8.31,14.27 v1(12.69,14.27)
  Bottom Layer w0.102: 9.75,13.75 9.28,14.23 v1(8.26,14.23)
SDO_TX: length 23.9
  Top Layer w0.102: v1(1.48,9.66) 1.48,9.63 1.97,9.14 2.71,9.14 2.72,9.16 ; v1(14.76,13.25) 15.34,13.82 U9.12
  Inner2 w0.102: v1(1.48,9.66) 1.48,9.63 1.99,9.12 2.22,9.12 2.76,8.59 4.55,8.59 8.88,12.91 8.88,13.39 9.08,13.59 11.48,13.59 11.84,13.23 14.74,13.23 v1(14.76,13.25)
  Bottom Layer w0.102: v1(14.76,13.25) 14.47,13.54 14.47,13.86 12.58,15.75 11.75,15.75
SWCK: length 15.6
  Top Layer w0.102: v1(1.88,6.66) 1.96,6.74 U2.7
  Inner1 w0.102: v1(8.38,17.1) 8.64,16.85 8.64,12.56 4.44,8.36 3.17,8.36 2.38,7.57 2.38,7.17 1.88,6.68 v1(1.88,6.66)
  Bottom Layer w0.102: v1(8.38,17.1) 8.38,17.12 7.75,17.75
SWD: length 16.3
  Top Layer w0.102: v1(2.19,6.09) 2.45,6.09 U2.8
  Inner1 w0.102: v1(2.19,6.09) 2.19,6.32 2.58,6.71 2.58,7.49 3.26,8.16 4.53,8.16 8.84,12.48 8.84,16.91 v1(9.09,17.16)
  Bottom Layer w0.102: 9.75,17.75 9.16,17.16 v1(9.09,17.16)
TX_LOG: length 13.9
  Top Layer w0.102: v1(3.49,5.27) 3.49,5.7 3.82,6.03 U2.11
  Bottom Layer w0.102: 7.75,15.75 7.75,15.52 6.88,14.64 6.88,13.61 7.25,13.24 7.25,11.18 4.96,8.89 4.96,7.49 3.49,6.03 v1(3.49,5.27)
V_RET: length 13.2
  Top Layer w0.102: 5.92,7.37 5.88,7.41 v1(5.58,7.41) 5.17,7.41 U2.17 ; R4.2 13.42,10.61 v1(13.42,11.97)
  Inner2 w0.102: v1(13.42,11.97) 13,12.38 9.91,12.38 9.81,12.48 v1(9.45,12.48)
  Bottom Layer w0.102: v1(9.45,12.48) 9.16,12.48 5.58,8.9 v1(5.58,7.41)
$1N117316: length 4.4
  Top Layer w0.102: U2.19 5.49,8.14 5.73,8.37 5.73,9.17 5.61,9.29 5.61,11.53 L3.1
$1N117324: length 1.1
  Top Layer w0.305: C20.2 11.78,0.95 U3.2
$1N117351: length 9.6
  Top Layer w0.102: C7.2 6.36,8.09 6.36,6.23 6.15,6.03 5.75,6.03 5.54,6.23 5.54,6.91 5.37,7.09 U2.16 ; C7.2 6.24,8.19 5.93,8.49 5.93,9.67 6.17,9.9 6.17,10.77 6.62,11.22 L3.2 ; C7.2 6.25,8.17 5.87,7.79 U2.18
$1N163267: length 1.7
  Top Layer w0.305: L2.1 C2.2 arc(4.94,4.56) C19.2
$1N163559: length 3.2
  Top Layer w0.152: v1(7.05,1.68) 7.05,2 7.17,2.12 C21.2
  Top Layer w0.305: L2.2 7.17,2.12 7.76,1.53
  Bottom Layer w0.381: TP23.1 7.24,1.87 v1(7.05,1.68)

## Copper pours and planes (outline as drawn; the poured copper is in the pictures)
GND on Top Layer: 23.15,11.06 23.12,11.75 23.04,12.42 22.93,13.1 22.77,13.76 22.58,14.42 22.36,15.06 22.1,15.69 21.8,16.3 21.47,16.9 21.11,17.48 20.72,18.03 20.29,18.57 19.84,19.07 19.35,19.56 18.85,20.01 18.31,20.44 17.76,20.83 17.18,21.19 16.58,21.52 15.97,21.82 15.34,22.08 14.7,22.3 14.04,22.49 13.38,22.65 12.7,22.76 12.03,22.84 11.34,22.87 10.66,22.87 9.98,22.84 9.3,22.76 8.63,22.65 7.97,22.49 7.31,22.3 6.67,22.08 6.04,21.82 5.43,21.52 4.83,21.19 4.25,20.83 3.69,20.44 3.16,20.01 2.65,19.56 2.17,19.07 1.72,18.57 1.29,18.03 0.9,17.48 0.53,16.9 0.2,16.3 -0.09,15.69 -0.35,15.06 -0.58,14.42 -0.77,13.76 -0.92,13.1 -1.03,12.42 -1.11,11.75 -1.15,11.06 -1.15,10.38 -1.11,9.7 -1.03,9.02 -0.92,8.35 -0.77,7.69 -0.58,7.03 -0.35,6.39 -0.09,5.76 0.2,5.15 0.53,4.55 0.9,3.97 1.29,3.41 1.72,2.88 2.17,2.37 2.65,1.89 3.16,1.44 3.69,1.01 4.25,0.62 4.83,0.25 5.43,-0.08 6.04,-0.37 6.67,-0.63 7.31,-0.86 7.97,-1.05 8.63,-1.2 9.3,-1.31 9.98,-1.39 10.66,-1.43 11.34,-1.43 12.03,-1.39 12.7,-1.31 13.38,-1.2 14.04,-1.05 14.7,-0.86 15.34,-0.63 15.97,-0.37 16.58,-0.08 17.18,0.25 17.76,0.62 18.31,1.01 18.85,1.44 19.35,1.89 19.84,2.37 20.29,2.88 20.72,3.41 21.11,3.97 21.47,4.55 21.8,5.15 22.1,5.76 22.36,6.39 22.58,7.03 22.77,7.69 22.93,8.35 23.04,9.02 23.12,9.7 23.15,10.38
GND on Bottom Layer: 22.54,11.14 22.51,11.82 22.43,12.5 22.32,13.17 22.16,13.84 21.98,14.49 21.75,15.14 21.49,15.77 21.19,16.38 20.86,16.98 20.5,17.55 20.11,18.11 19.68,18.64 19.23,19.15 18.74,19.63 18.24,20.09 17.7,20.51 17.15,20.91 16.57,21.27 15.97,21.6 15.36,21.9 14.73,22.16 14.09,22.38 13.43,22.57 12.77,22.72 12.09,22.84 11.42,22.91 10.74,22.95 10.05,22.95 9.37,22.91 8.7,22.84 8.02,22.72 7.36,22.57 6.7,22.38 6.06,22.16 5.43,21.9 4.82,21.6 4.22,21.27 3.64,20.91 3.09,20.51 2.55,20.09 2.04,19.63 1.56,19.15 1.11,18.64 0.68,18.11 0.29,17.55 -0.07,16.98 -0.4,16.38 -0.7,15.77 -0.96,15.14 -1.19,14.49 -1.38,13.84 -1.53,13.17 -1.64,12.5 -1.72,11.82 -1.76,11.14 -1.76,10.46 -1.72,9.78 -1.64,9.1 -1.53,8.43 -1.38,7.76 -1.19,7.11 -0.96,6.47 -0.7,5.84 -0.4,5.22 -0.07,4.63 0.29,4.05 0.68,3.49 1.11,2.96 1.56,2.45 2.04,1.97 2.55,1.51 3.09,1.09 3.64,0.69 4.22,0.33 4.82,0 5.43,-0.29 6.06,-0.55 6.7,-0.78 7.36,-0.97 8.02,-1.12 8.7,-1.23 9.37,-1.31 10.05,-1.35 10.74,-1.35 11.42,-1.31 12.09,-1.23 12.77,-1.12 13.43,-0.97 14.09,-0.78 14.73,-0.55 15.36,-0.29 15.97,0 16.57,0.33 17.15,0.69 17.7,1.09 18.24,1.51 18.74,1.97 19.23,2.45 19.68,2.96 20.11,3.49 20.5,4.05 20.86,4.63 21.19,5.22 21.49,5.84 21.75,6.47 21.98,7.11 22.16,7.76 22.32,8.43 22.43,9.1 22.51,9.78 22.54,10.46
GND on Inner1: 22.8,10.99 22.76,11.67 22.68,12.35 22.57,13.02 22.42,13.68 22.23,14.34 22,14.98 21.74,15.61 21.45,16.23 21.12,16.82 20.76,17.4 20.36,17.96 19.94,18.49 19.48,19 19,19.48 18.49,19.94 17.96,20.36 17.4,20.76 16.82,21.12 16.23,21.45 15.61,21.74 14.98,22 14.34,22.23 13.68,22.42 13.02,22.57 12.35,22.68 11.67,22.76 10.99,22.8 10.31,22.8 9.63,22.76 8.95,22.68 8.28,22.57 7.61,22.42 6.96,22.23 6.31,22 5.68,21.74 5.07,21.45 4.47,21.12 3.9,20.76 3.34,20.36 2.81,19.94 2.3,19.48 1.82,19 1.36,18.49 0.94,17.96 0.54,17.4 0.18,16.82 -0.15,16.23 -0.45,15.61 -0.71,14.98 -0.93,14.34 -1.12,13.68 -1.27,13.02 -1.39,12.35 -1.46,11.67 -1.5,10.99 -1.5,10.31 -1.46,9.63 -1.39,8.95 -1.27,8.28 -1.12,7.61 -0.93,6.96 -0.71,6.31 -0.45,5.68 -0.15,5.07 0.18,4.47 0.54,3.9 0.94,3.34 1.36,2.81 1.82,2.3 2.3,1.82 2.81,1.36 3.34,0.94 3.9,0.54 4.47,0.18 5.07,-0.15 5.68,-0.45 6.31,-0.71 6.96,-0.93 7.61,-1.12 8.28,-1.27 8.95,-1.39 9.63,-1.46 10.31,-1.5 10.99,-1.5 11.67,-1.46 12.35,-1.39 13.02,-1.27 13.68,-1.12 14.34,-0.93 14.98,-0.71 15.61,-0.45 16.23,-0.15 16.82,0.18 17.4,0.54 17.96,0.94 18.49,1.36 19,1.82 19.48,2.3 19.94,2.81 20.36,3.34 20.76,3.9 21.12,4.47 21.45,5.07 21.74,5.68 22,6.31 22.23,6.96 22.42,7.61 22.57,8.28 22.68,8.95 22.76,9.63 22.8,10.31
GND on Inner2: 22.9,11.34 22.86,12.03 22.79,12.7 22.67,13.38 22.52,14.04 22.33,14.7 22.11,15.34 21.84,15.97 21.55,16.58 21.22,17.18 20.86,17.76 20.46,18.31 20.04,18.85 19.58,19.35 19.1,19.84 18.59,20.29 18.06,20.72 17.5,21.11 16.93,21.47 16.33,21.8 15.71,22.1 15.08,22.36 14.44,22.58 13.79,22.77 13.12,22.93 12.45,23.04 11.77,23.12 11.09,23.15 10.41,23.15 9.73,23.12 9.05,23.04 8.38,22.93 7.71,22.77 7.06,22.58 6.42,22.36 5.79,22.1 5.17,21.8 4.57,21.47 4,21.11 3.44,20.72 2.91,20.29 2.4,19.84 1.92,19.35 1.46,18.85 1.04,18.31 0.64,17.76 0.28,17.18 -0.05,16.58 -0.34,15.97 -0.61,15.34 -0.83,14.7 -1.02,14.04 -1.17,13.38 -1.29,12.7 -1.36,12.03 -1.4,11.34 -1.4,10.66 -1.36,9.98 -1.29,9.3 -1.17,8.63 -1.02,7.97 -0.83,7.31 -0.61,6.67 -0.34,6.04 -0.05,5.43 0.28,4.83 0.64,4.25 1.04,3.69 1.46,3.16 1.92,2.65 2.4,2.17 2.91,1.72 3.44,1.29 4,0.9 4.57,0.53 5.17,0.2 5.79,-0.09 6.42,-0.35 7.06,-0.58 7.71,-0.77 8.38,-0.92 9.05,-1.03 9.73,-1.11 10.41,-1.15 11.09,-1.15 11.77,-1.11 12.45,-1.03 13.12,-0.92 13.79,-0.77 14.44,-0.58 15.08,-0.35 15.71,-0.09 16.33,0.2 16.93,0.53 17.5,0.9 18.06,1.29 18.59,1.72 19.1,2.17 19.58,2.65 20.04,3.16 20.46,3.69 20.86,4.25 21.22,4.83 21.55,5.43 21.84,6.04 22.11,6.67 22.33,7.31 22.52,7.97 22.67,8.63 22.79,9.3 22.86,9.98 22.9,10.66

Small or netless copper shapes (teardrops, artwork), in the pictures only: 160 on Top Layer, 51 on Bottom Layer, 10 on Inner1, 25 on Inner2

## Text on the board
Bottom Assembly Layer: VBAT | GND | NRST | TX_T | SWCK | CS | SID_RX | SWD | DRDY | SCLK | RX_T | SDO_TX | VDD | LATCH | OCDSCK | OP3N/RE | OP3O/CE | OCDSDA | DACVREF | OP1O | OP1N/WE
Bottom Silkscreen Layer: 3.0V CGM / BH66F2455 / HT32F67595 | BMHB2018-DB | V1.0
Top Silkscreen Layer: RE | CE | WE | CR920-3.0V | CGM | + | -
